# Altium schematic sheet EthernetT1S.SchDoc
size A3
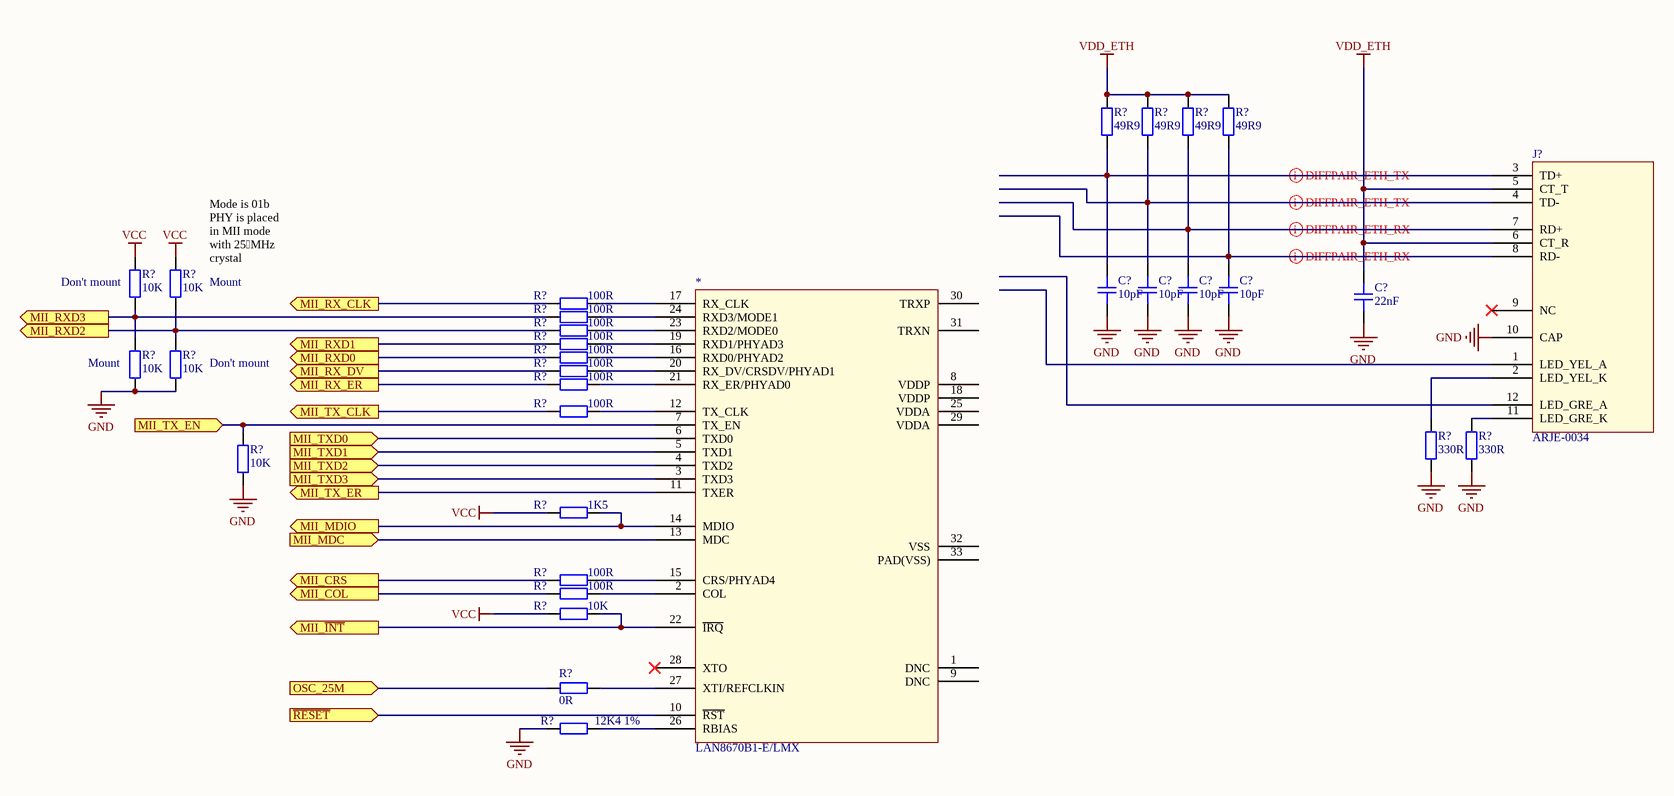
[diagram p0: EthernetT1S.SchDoc]

## Parts
(Parts that share a designator on the sheet are numbered #1, #2 ... from top to bottom, then left to right.)
*  LAN8670B1-E/LMX
C?#1  value 10pF  (hidden comment: C-10pF-0603)
C?#2  value 10pF  (hidden comment: C-10pF-0603)
C?#3  value 10pF  (hidden comment: C-10pF-0603)
C?#4  value 10pF  (hidden comment: C-10pF-0603)
C?#5  value 22nF  (hidden comment: C-22nF-0603)
J?  ARJE-0034
R?#1  value 49R9  (hidden comment: R-49R9-0603)
R?#2  value 49R9  (hidden comment: R-49R9-0603)
R?#3  value 49R9  (hidden comment: R-49R9-0603)
R?#4  value 49R9  (hidden comment: R-49R9-0603)
R?#5  value 10K  (hidden comment: R-10K-0603)
R?#6  value 10K  (hidden comment: R-10K-0603)
R?#7  value 100R  (hidden comment: R-100R-0603)
R?#8  value 100R  (hidden comment: R-100R-0603)
R?#9  value 100R  (hidden comment: R-100R-0603)
R?#10  value 100R  (hidden comment: R-100R-0603)
R?#11  value 100R  (hidden comment: R-100R-0603)
R?#12  value 10K  (hidden comment: R-10K-0603)
R?#13  value 10K  (hidden comment: R-10K-0603)
R?#14  value 100R  (hidden comment: R-100R-0603)
R?#15  value 100R  (hidden comment: R-100R-0603)
R?#16  value 100R  (hidden comment: R-100R-0603)
R?#17  value 330R  (hidden comment: R-330R-0603)
R?#18  value 330R  (hidden comment: R-330R-0603)
R?#19  value 10K  (hidden comment: R-10K-0603)
R?#20  value 1K5  (hidden comment: R-1K5-0603)
R?#21  value 100R  (hidden comment: R-100R-0603)
R?#22  value 100R  (hidden comment: R-100R-0603)
R?#23  value 10K  (hidden comment: R-10K-0603)
R?#24  value 0R  (hidden comment: R-0R-0603)
R?#25  value 12K4 1%  (hidden comment: R-12K4-1%-0603)

## Ports
MII_COL (out), MII_CRS (out), MII_MDC (in), MII_MDIO (out), MII_RX_CLK (out), MII_RX_DV (out), MII_RX_ER (out), MII_RXD0 (out), MII_RXD1 (out), MII_RXD2 (out), MII_RXD3 (out), MII_TX_CLK (out), MII_TX_EN (in), MII_TX_ER (out), MII_TXD0 (in), MII_TXD1 (in), MII_TXD2 (in), MII_TXD3 (in), MII_~{INT} (out), OSC_25M (in), ~{RESET} (in)

## Nets
GND: C?#1.1 C?#2.1 C?#3.1 C?#4.1 C?#5.1 J?.10(CAP) R?#12.1 R?#13.1 R?#17.1 R?#18.1 R?#19.1 R?#25.1
VCC: R?#5.2 R?#6.2 R?#20.1 R?#23.1
VDD_ETH: C?#5.2 J?.5(CT_T) J?.6(CT_R) R?#1.2 R?#2.2 R?#3.2 R?#4.2
MII_COL: R?#22.1 ; port MII_COL
MII_CRS: R?#21.1 ; port MII_CRS
MII_~{INT}: *.22(~{IRQ}) R?#23.2 ; port MII_~{INT}
MII_MDC: *.13(MDC) ; port MII_MDC
MII_MDIO: *.14(MDIO) R?#20.2 ; port MII_MDIO
MII_RX_CLK: R?#7.1 ; port MII_RX_CLK
MII_RX_DV: R?#14.1 ; port MII_RX_DV
MII_RX_ER: R?#15.1 ; port MII_RX_ER
MII_RXD0: R?#11.1 ; port MII_RXD0
MII_RXD1: R?#10.1 ; port MII_RXD1
MII_RXD2: R?#6.1 R?#9.1 R?#13.2 ; port MII_RXD2
MII_RXD3: R?#5.1 R?#8.1 R?#12.2 ; port MII_RXD3
MII_TX_CLK: R?#16.1 ; port MII_TX_CLK
MII_TX_EN: *.7(TX_EN) R?#19.2 ; port MII_TX_EN
MII_TX_ER: *.11(TXER) ; port MII_TX_ER
MII_TXD0: *.6(TXD0) ; port MII_TXD0
MII_TXD1: *.5(TXD1) ; port MII_TXD1
MII_TXD2: *.4(TXD2) ; port MII_TXD2
MII_TXD3: *.3(TXD3) ; port MII_TXD3
OSC_25M: R?#24.1 ; port OSC_25M
~{RESET}: *.10(~{RST}) ; port ~{RESET}
Net*_2: *.2(COL) R?#22.2
Net*_12: *.12(TX_CLK) R?#16.2
Net*_15: *.15(CRS/PHYAD4) R?#21.2
Net*_16: *.16(RXD0/PHYAD2) R?#11.2
Net*_17: *.17(RX_CLK) R?#7.2
Net*_19: *.19(RXD1/PHYAD3) R?#10.2
Net*_20: *.20(RX_DV/CRSDV/PHYAD1) R?#14.2
Net*_21: *.21(RX_ER/PHYAD0) R?#15.2
Net*_23: *.23(RXD2/MODE0) R?#9.2
Net*_24: *.24(RXD3/MODE1) R?#8.2
Net*_26: *.26(RBIAS) R?#25.2
Net*_27: *.27(XTI/REFCLKIN) R?#24.2
NetC?#1_2: C?#1.2 J?.3(TD+) R?#1.1
NetC?#2_2: C?#2.2 J?.4(TD-) R?#2.1
NetC?#3_2: C?#3.2 J?.7(RD+) R?#3.1
NetC?#4_2: C?#4.2 J?.8(RD-) R?#4.1
NetJ?_2: J?.2(LED_YEL_K) R?#17.2
NetJ?_11: J?.11(LED_GRE_K) R?#18.2

Not connected (* = marked no-connect by the designer): * 1(DNC) 8(VDDP) 9(DNC) 18(VDDP) 25(VDDA) 28(XTO)* 29(VDDA) 30(TRXP) 31(TRXN) 32(VSS) 33(PAD(VSS)); J? 1(LED_YEL_A) 9(NC)* 12(LED_GRE_A)

## Layout directives
differential pair: NetC?#1_2, NetC?#2_2, NetC?#3_2, NetC?#4_2

## Notes on the sheet
- (near R?#5) Don't mount
- (near R?#6) Mount
- (near R?#6) Mode is 01b PHY is placed in MII mode with 25 MHz crystal
- (near R?#12) Mount
- (near R?#13) Don't mount

## Library data of the parts
J? = ARJE-0034: Supplier 1: Digi-Key; Supplier Part Number 1: 535-12443-1-ND